# EasyEDA schematic truco.json
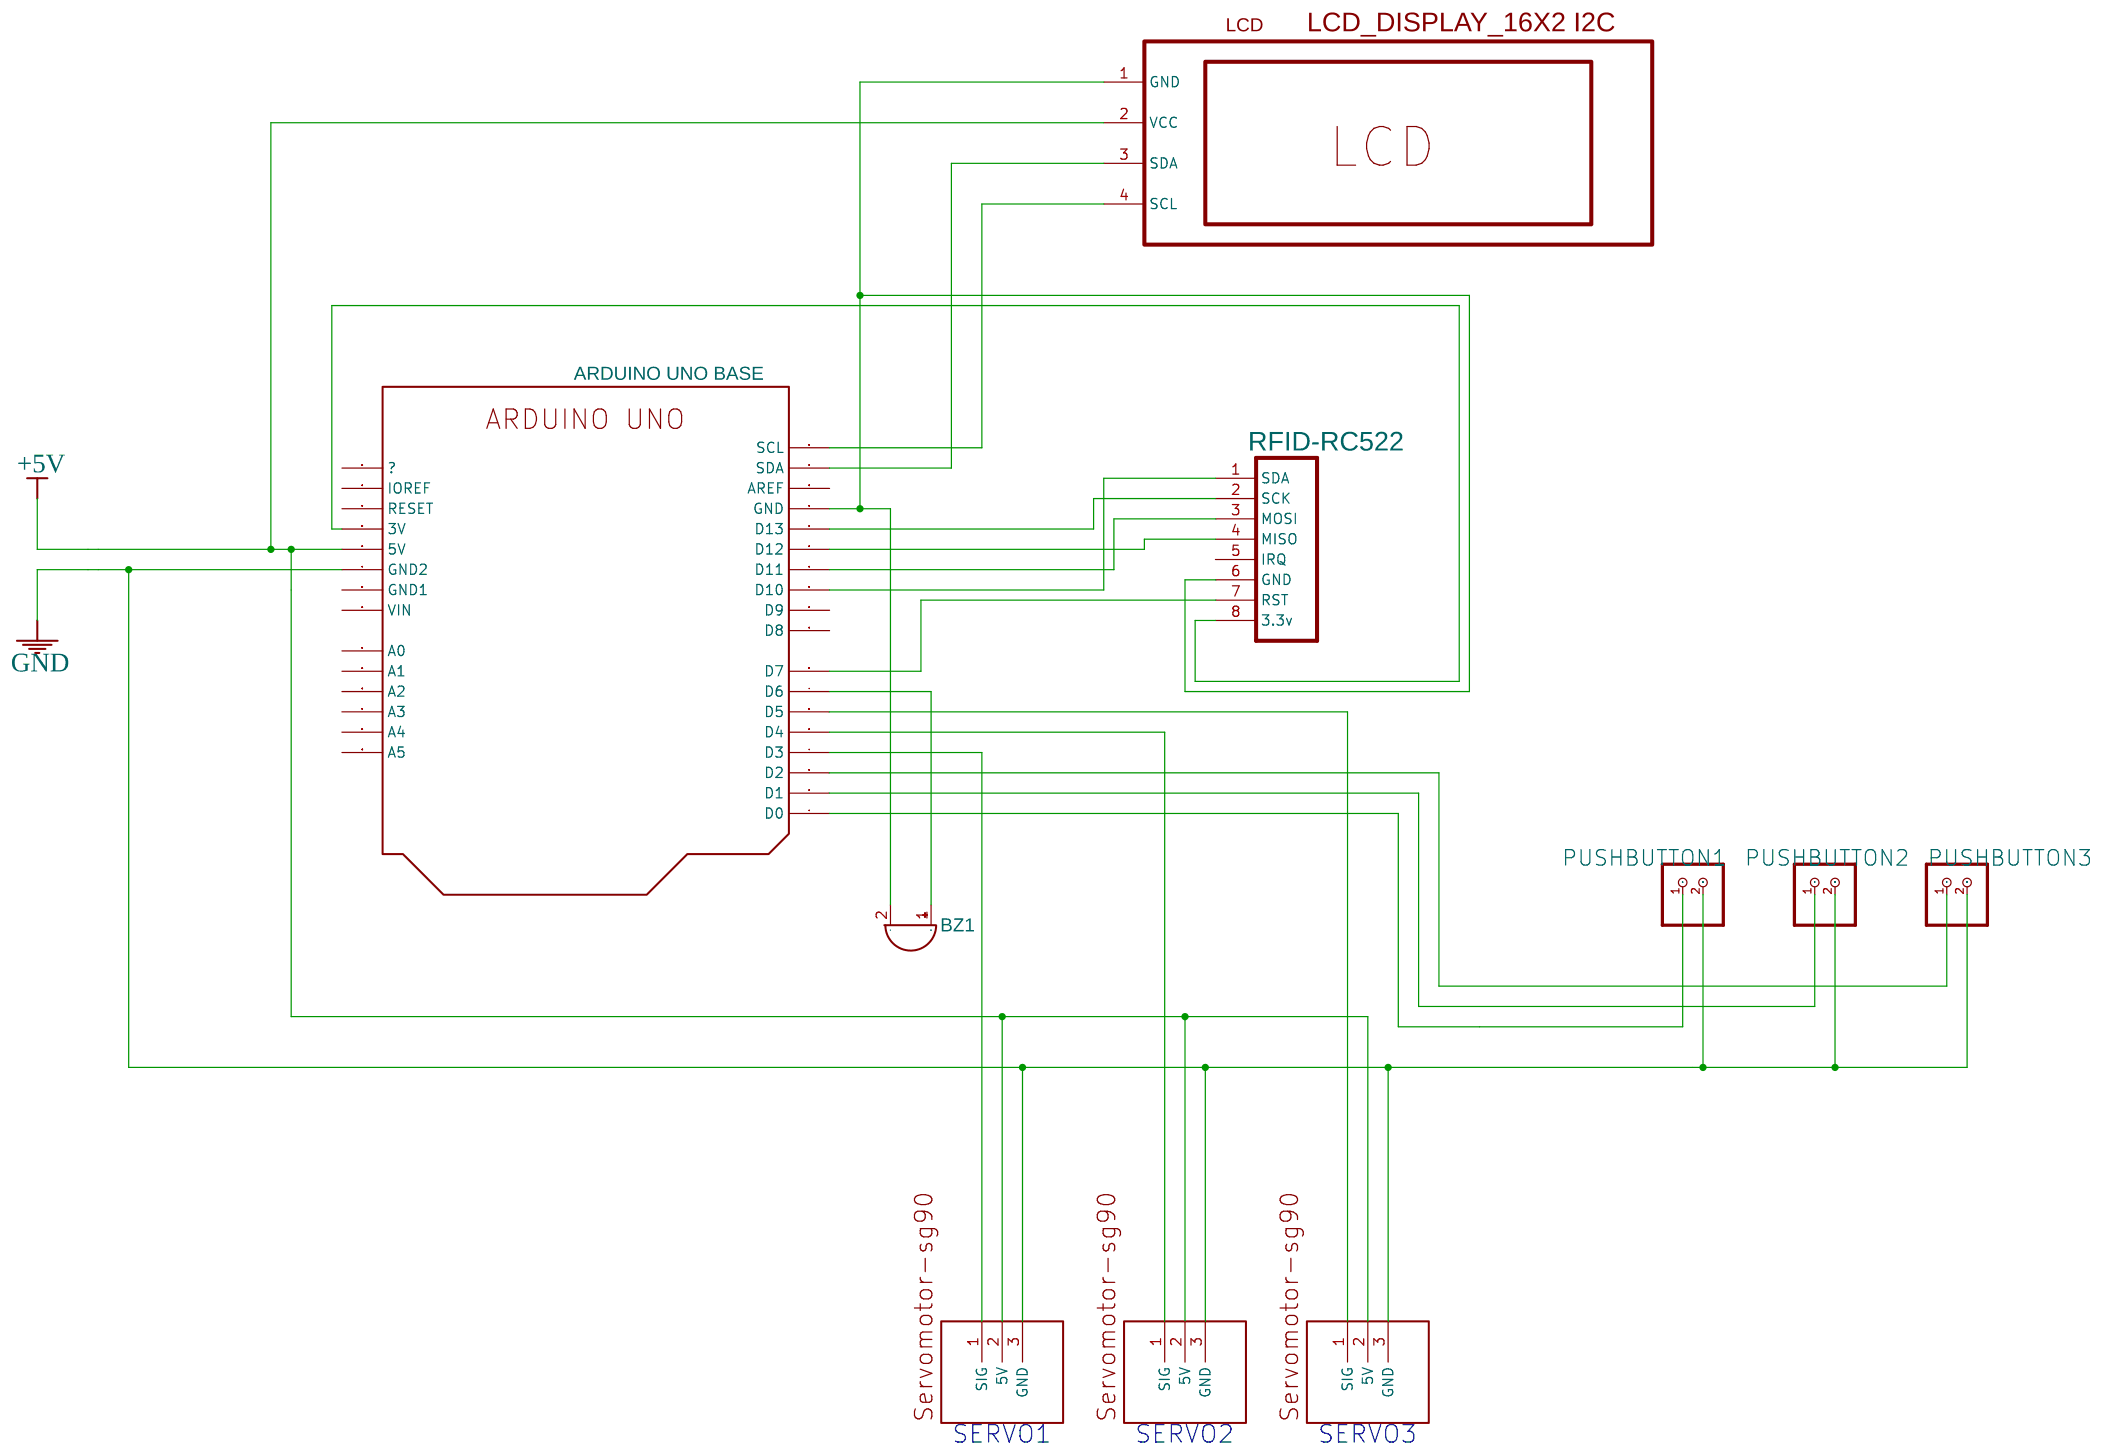
[diagram p0: schematic sheet]

## Parts
BZ1  BUZZER 12X9.5 FATHBOARD  [BUZZER_BEEPER:BUZZER_12X9.5RM7.6]
JP1  RFID-RC522  [RFID-RC522-ST]
PUSHBUTTON1  PINHD-1X2  [1X02]
PUSHBUTTON2  PINHD-1X2  [1X02]
PUSHBUTTON3  PINHD-1X2  [1X02]
U1  Servomotor sg90 - MG90S  [SERVOMOTOR-SG90]
U2  Servomotor sg90 - MG90S  [SERVOMOTOR-SG90]
U3  Servomotor sg90 - MG90S  [SERVOMOTOR-SG90]
U5  ARDUINO UNO BASE  [UNO_R3;WO ARDUINO UNO]
U7  LCD 16x2 I2C Anschluss  [I2C MODULE WITH 16X2 DISPLAY CONNECTOR]

## Library data of the parts
BZ1 = BUZZER 12X9.5 FATHBOARD: Symbol: Device_Buzzer; Device: Device_Buzzer; Add into BOM: yes; Convert to PCB: yes; Origin Footprint: Buzzer_Beeper:Buzzer_12x9.5RM7.6; Contributor: t.teenoom
JP1 = RFID-RC522_2: Header 4; Contributor: ngyattila
U1-U3 = Servomotor sg90 - MG90S: Contributor: ti47
U5 = ARDUINO UNO BASE: Contributor: obaida.bohsas.shark; sourceId: frlCUcuMG
U7 = LCD 16x2 I2C Anschluss: Contributor: websto

## Nets
+5V: U1.2(5V) U2.2(5V) U3.2(5V) U5.28(5V) U7.2(VCC)
GND: PUSHBUTTON1.2 PUSHBUTTON2.2 PUSHBUTTON3.2 U1.3(GND) U2.3(GND) U3.3(GND) U5.27(GND2)
Net-(BZ1-1): BZ1.1(+) U5.7(D6)
Net-(BZ1-2): BZ1.2(-) JP1.6(GND) U5.15(GND) U7.1(GND)
Net-(JP1-1): JP1.1(SDA) U5.11(D10)
Net-(JP1-2): JP1.2(SCK) U5.14(D13)
Net-(JP1-3): JP1.3(MOSI) U5.12(D11)
Net-(JP1-4): JP1.4(MISO) U5.13(D12)
Net-(JP1-7): JP1.7(RST) U5.8(D7)
Net-(JP1-8): JP1.8(3.3v) U5.29(3V)
Net-(PUSHBUTTON1-1): PUSHBUTTON1.1 U5.1(D0)
Net-(PUSHBUTTON2-1): PUSHBUTTON2.1 U5.2(D1)
Net-(PUSHBUTTON3-1): PUSHBUTTON3.1 U5.3(D2)
Net-(U1-1): U1.1(SIG) U5.4(D3)
Net-(U2-1): U2.1(SIG) U5.5(D4)
Net-(U3-1): U3.1(SIG) U5.6(D5)
Net-(U5-17): U5.17(SDA) U7.3(SDA)
Net-(U5-18): U5.18(SCL) U7.4(SCL)

Not connected (* = marked no-connect by the designer): JP1 5(IRQ); U5 9(D8) 10(D9) 16(AREF) 19(A5) 20(A4) 21(A3) 22(A2) 23(A1) 24(A0) 25(VIN) 26(GND1) 30(RESET) 31(IOREF) 32(?)

## Notes on the sheet
- SERVO1
- SERVO2
- SERVO3
